# EAGLE schematic dtmf_robot (EAGLE 6.1)
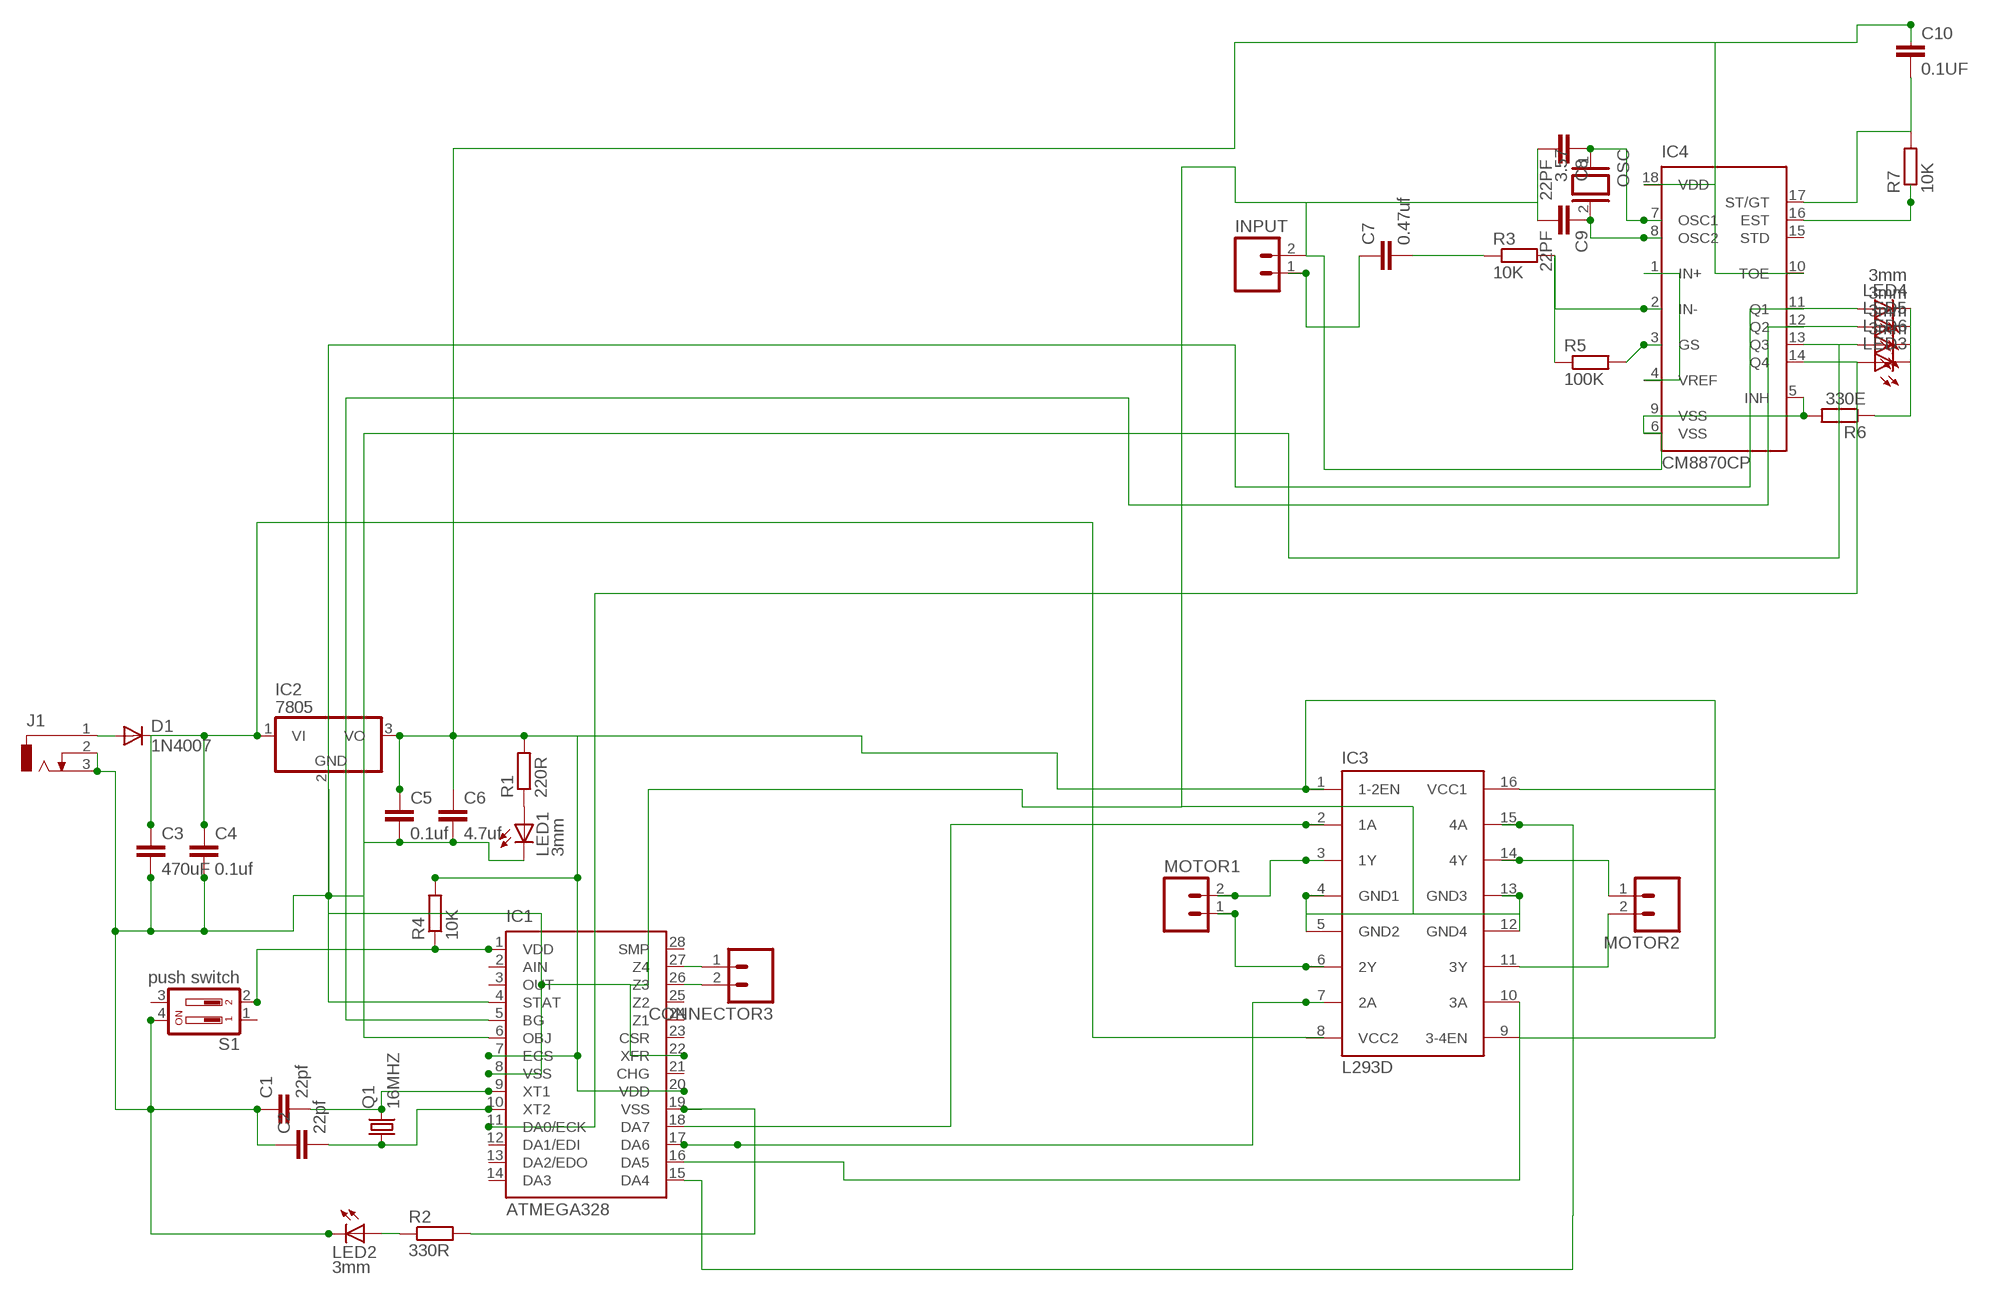
[diagram p0: schematic, sheet 1]

## Parts
C1  22pf  C2.5/2  [C2.5-2]
C2  22pf  C2.5/2  [C2.5-2]
C3  470uF  C2.5/2  [C2.5-2]
C4  0.1uf  C2.5/2  [C2.5-2]
C5  0.1uf  C2.5/2  [C2.5-2]
C6  4.7uf  C2.5/2  [C2.5-2]
C7  0.47uf  C2.5/2  [C2.5-2]
C8  22PF  C2.5/2  [C2.5-2]
C9  22PF  C2.5/2  [C2.5-2]
C10  0.1UF  C2.5/2  [C2.5-2]
CONNECTOR3  M02  [02P]
D1  1N4007  1N4004  [DO41-10]
IC1  ATMEGA328  QT9701BD  [DIL28-3]
IC2  7805  786TV  [TO220V]
IC3  L293D  [DIL16]
IC4  CM8870CP  [DIL18]
INPUT  M02  [02P]
J1  DCJ0303  [DCJ0303]
LED1  3mm  LED3MM  [LED3MM]
LED2  3mm  LED3MM  [LED3MM]
LED3  3mm  LED3MM  [LED3MM]
LED4  3mm  LED3MM  [LED3MM]
LED5  3mm  LED3MM  [LED3MM]
LED6  3mm  LED3MM  [LED3MM]
MOTOR1  M02  [02P]
MOTOR2  M02  [02P]
OSC  3.57  XTAL/S  [QS]
Q1  16MHZ  CRYSTALHC49S  [HC49/S]
R1  220R  R-EU_0207/10  [0207/10]
R2  330R  R-EU_0207/10  [0207/10]
R3  10K  R-EU_0204/7  [0204/7]
R4  10K  R-EU_0207/10  [0207/10]
R5  100K  R-EU_0204/7  [0204/7]
R6  330E  R-EU_0204/7  [0204/7]
R7  10K  R-EU_0204/7  [0204/7]
S1  push switch  DP02  [DP-02]

## Nets
N$1: C1.2 IC1.9(XT1) Q1.2
N$2: C2.2 IC1.10(XT2) Q1.1
N$3: D1.A J1.1
N$4: C3.1 C4.1 D1.C IC2.1(VI) IC3.8(VCC2)
N$5: C1.1 C2.1 C3.2 C4.2 C5.2 C6.2 C8.2 C9.2 IC1.8(VSS) IC1.22(XFR) IC2.2(GND) IC3.4(GND1) IC3.5(GND2) IC3.12(GND4) IC3.13(GND3) IC4.5(INH) IC4.6(VSS) IC4.9(VSS) INPUT.2 J1.2 J1.3 LED1.K(C) LED2.K(C) R6.2 S1.4
N$6: LED1.A R1.1
N$7: IC1.17(DA6) IC3.7(2A)
N$8: IC1.4(STAT) IC4.11(Q1) LED4.A
N$9: IC1.5(BG) IC4.12(Q2) LED5.A
N$10: IC1.6(OBJ) IC4.13(Q3) LED6.A
N$11: IC1.11(DA0/ECK) IC4.14(Q4) LED3.A
N$12: CONNECTOR3.1 IC1.27(Z4)
N$13: CONNECTOR3.2 IC1.26(Z3)
N$15: IC1.18(DA7) IC3.2(1A)
N$16: IC1.15(DA4) IC3.15(4A)
N$20: C7.2 R3.1
N$21: IC1.16(DA5) IC3.10(3A)
N$24: C10.2 IC4.17(ST/GT) R7.2
N$25: IC3.14(4Y) MOTOR2.1
N$27: IC1.19(VSS) R2.2
N$28: IC3.11(3Y) MOTOR2.2
N$31: IC1.1(VDD) R4.1 S1.2
N$32: LED2.A R2.1
N$34: IC3.6(2Y) MOTOR1.1
N$35: IC3.3(1Y) MOTOR1.2
N$36: LED3.K(C) LED4.K(C) LED5.K(C) LED6.K(C) R6.1
N$37: C5.1 C6.1 C10.1 IC1.7(ECS) IC1.20(VDD) IC2.3(VO) IC3.1(1-2EN) IC3.9(3-4EN) IC3.16(VCC1) IC4.10(TOE) IC4.18(VDD) R1.2 R4.2
N$38: C7.1 INPUT.1
N$39: IC4.2(IN-) R3.2 R5.1
N$40: IC4.1(IN+) IC4.4(VREF)
N$41: IC4.3(GS) R5.2
N$42: C8.1 IC4.7(OSC1) OSC.1
N$43: C9.1 IC4.8(OSC2) OSC.2
N$44: IC4.16(EST) R7.1
Unconnected: IC1.2(AIN) IC1.3(OUT) IC1.12(DA1/EDI) IC1.13(DA2/EDO) IC1.14(DA3) IC1.21(CHG) IC1.23(CSR) IC1.24(Z1) IC1.25(Z2) IC1.28(SMP) IC4.15(STD) S1.1 S1.3

## Library data of the parts
C1-C10 = capacitor-wima:C: CAPACITOR naming: grid - package width
CONNECTOR3 INPUT MOTOR1 MOTOR2 = con-amp-quick:M02: AMP QUICK CONNECTOR; OC_FARNELL: unknown; OC_NEWARK: unknown
D1 = diode:1N4004: DIODE general purpose rectifier, 1 A
IC1 = quantum-research-group:QT9701B: Charge-Transfer Capacitance Sensor IC Source: http://data.qprox.com/downloads/datasheets/qt9701b.pdf; OC_FARNELL: unknown; OC_NEWARK: unknown
IC2 = linear:78*: Positive VOLTAGE REGULATOR Source: http://cache.national.com/ds/LM/LM78L05.pdf http://www.fairchildsemi.com/ds/LM/LM7805.pdf
IC3 = st-microelectronics:L293D: PUSH-PULL 4 CHANNEL DRIVER; MPN: L293D; OC_FARNELL: 9589619; OC_NEWARK: 56P8249
IC4 = california-micro-devices:CM8870C: CMOS Integrated DTMF Receiver cm8870.pdf; OC_FARNELL: unknown; OC_NEWARK: unknown
J1 = con-jack:DCJ0303: DC POWER JACK Source: DCJ0303.pdf; OC_FARNELL: unknown; OC_NEWARK: unknown
LED1-LED6 = led:LED: LED OSRAM: - CHIPLED LG R971, LG N971, LY N971, LG Q971, LY Q971, LO R971, LY R971 LH N974, LH R974 LS Q976, LO Q976, LY Q976 LO Q996 - Hyper CHIPLED LW Q18S LB Q993, LB Q99A, LB R99A - SideLED LS A670, LO A670, LY A670, LG A670, LP A670 LB A673, LV A673, LT A673, LW A673 LH A674 LY A675 LS A676, LA A676, LO A676, LY A676, LW A676 LS A679, LY A679, LG A679 - Hyper Micro SIDELED® LS Y876, LA Y876, LO Y876, LY Y876 LT Y87S - SmartLED LW L88C, LW L88S LB L89C, LB L89S, LG L890 LS L89K, LO L89K, LY L89K LS L896, LA L896, LO L896, LY L896 - TOPLED LS T670, LO T670, LY T670, LG T670, LP T670 LSG T670, LSP T670, LSY T670, LOP T670, LYG T670 LG T671, LOG T671, LSG T671 LB T673, LV T673, LT T673, LW T673 LH T674 LS T676, LA T676, LO T676, LY T676, LB T676, LH T676, LSB T676, LW T676 LB T67C, LV T67C, LT T67C, LS T67K, LO T67K, LY T67K, LW E67C LS E67B, LA E67B, LO E67B, LY E67B, LB E67C, LV E67C, LT E67C LW T67C LS T679, LY T679, LG T679 LS T770, LO T770, LY T770, LG T770, LP T770 LB T773, LV T773, LT T773, LW T773 LH T774 LS E675, LA E675, LY E675, LS T675 LS T776, LA T776, LO T776, LY T776, LB T776 LHGB T686 LT T68C, LB T68C - Hyper Mini TOPLED® LB M676 - Mini TOPLED Santana® LG M470 LS M47K, LO M47K, LY M47K Source: http://www.osram.convergy.de LUXEON: - LUMILED® LXK2-PW12-R00, LXK2-PW12-S00, LXK2-PW14-U00, LXK2-PW14-V00 LXK2-PM12-R00, LXK2-PM12-S00, LXK2-PM14-U00 LXK2-PE12-Q00, LXK2-PE12-R00, LXK2-PE12-S00, LXK2-PE14-T00, LXK2-PE14-U00 LXK2-PB12-K00, LXK2-PB12-L00, LXK2-PB12-M00, LXK2-PB14-N00, LXK2-PB14-P00, LXK2-PB14-Q00 LXK2-PR12-L00, LXK2-PR12-M00, LXK2-PR14-Q00, LXK2-PR14-R00 LXK2-PD12-Q00, LXK2-PD12-R00, LXK2-PD12-S00 LXK2-PH12-R00, LXK2-PH12-S00 LXK2-PL12-P00, LXK2-PL12-Q00, LXK2-PL12-R00 Source: www.luxeon.com KINGBRIGHT: KA-3528ASYC Source: www.kingbright.com
OSC = special:XTAL/S: CRYSTAL
Q1 = crystal:CRYSTAL: CRYSTAL; OC_FARNELL: 1667008; OC_NEWARK: unknown
R1-R7 = rcl:R-EU_: RESISTOR, European symbol
S1 = switch-dil:DP02: DIL/CODE SWITCH; MPN: MCDP02; OC_FARNELL: 1255233; OC_NEWARK: 26M1095